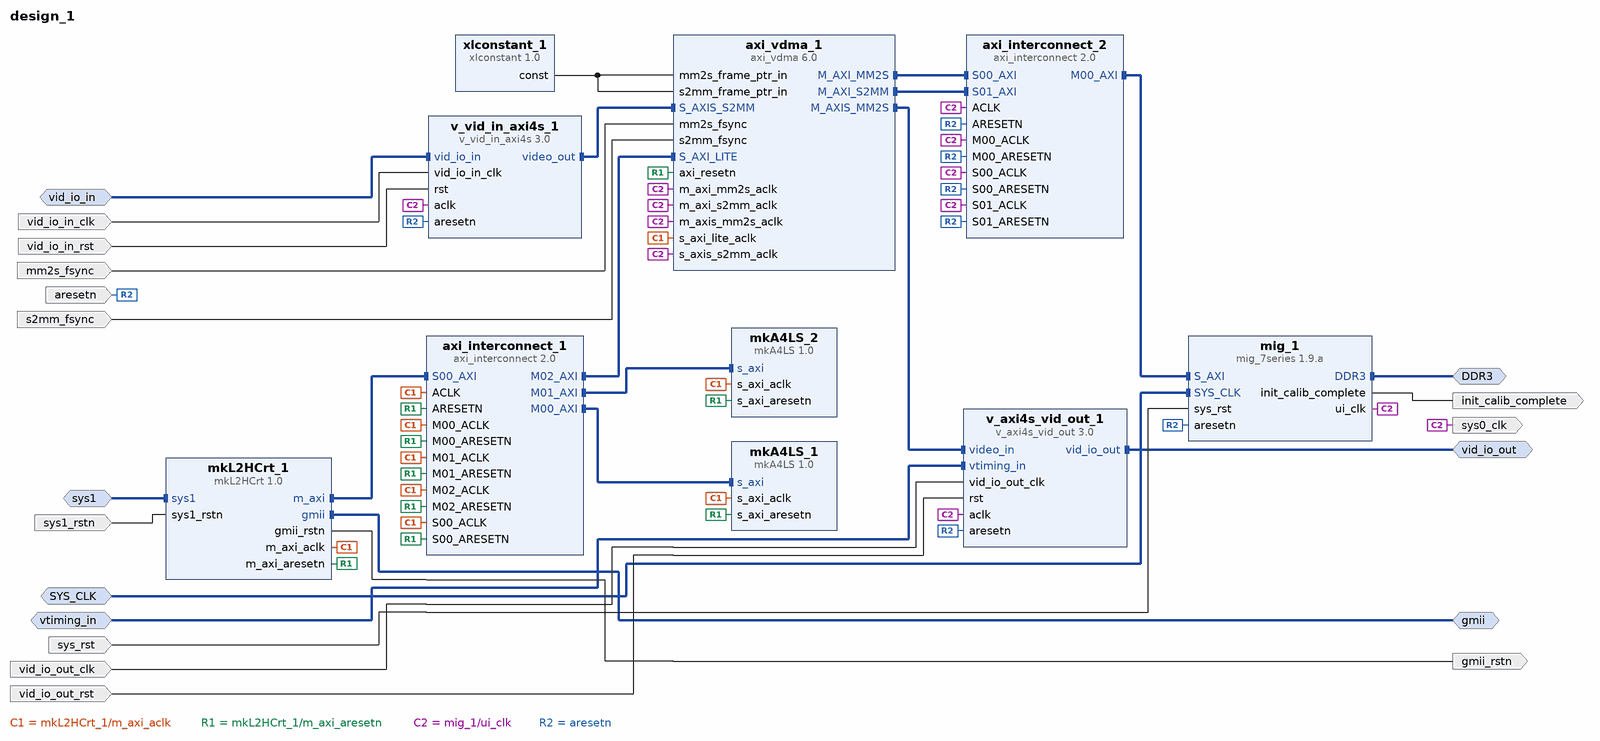
[diagram p0: block diagram of the top level]
# Vivado block design design_1, Vivado 2013.1.0
create_bd_design design_1

create_bd_intf_port -mode Master -vlnv xilinx.com:interface:gmii_rtl:1.0 gmii
create_bd_intf_port -mode Slave -vlnv xilinx.com:interface:diff_clock_rtl:1.0 sys1
set_property -dict {CONFIG.FREQ_HZ 125000000} [get_bd_intf_ports sys1]
create_bd_intf_port -mode Slave -vlnv xilinx.com:interface:diff_clock_rtl:1.0 SYS_CLK
set_property -dict {CONFIG.FREQ_HZ 200000000} [get_bd_intf_ports SYS_CLK]
create_bd_intf_port -mode Master -vlnv xilinx.com:interface:ddrx_rtl:1.0 DDR3
create_bd_intf_port -mode Master -vlnv xilinx.com:interface:vid_io_rtl:1.0 vid_io_out
create_bd_intf_port -mode Slave -vlnv xilinx.com:interface:video_timing_rtl:2.0 vtiming_in
create_bd_intf_port -mode Slave -vlnv xilinx.com:interface:vid_io_rtl:1.0 vid_io_in
create_bd_port -dir O -type rst gmii_rstn
set_property -dict {CONFIG.POLARITY ACTIVE_HIGH} [get_bd_ports gmii_rstn]
create_bd_port -dir I sys1_rstn
create_bd_port -dir I -type rst sys_rst
set_property -dict {CONFIG.POLARITY ACTIVE_HIGH} [get_bd_ports sys_rst]
create_bd_port -dir O init_calib_complete
create_bd_port -dir O -type clk sys0_clk
set_property -dict {CONFIG.FREQ_HZ 200000000 CONFIG.PHASE 337.5 CONFIG.CLK_DOMAIN design_1_mig_1_0_ui_clk} [get_bd_ports sys0_clk]
create_bd_port -dir I -type rst aresetn
set_property -dict {CONFIG.POLARITY ACTIVE_LOW} [get_bd_ports aresetn]
create_bd_port -dir I vid_io_in_clk
create_bd_port -dir I vid_io_out_clk
create_bd_port -dir I mm2s_fsync
create_bd_port -dir I s2mm_fsync
create_bd_port -dir I -type rst vid_io_in_rst
set_property -dict {CONFIG.POLARITY ACTIVE_HIGH} [get_bd_ports vid_io_in_rst]
create_bd_port -dir I -type rst vid_io_out_rst
set_property -dict {CONFIG.POLARITY ACTIVE_HIGH} [get_bd_ports vid_io_out_rst]

create_bd_cell -type ip -vlnv atomicrules.com:hotline:mkA4LS:1.0 mkA4LS_1
create_bd_cell -type ip -vlnv atomicrules.com:hotline:mkL2HCrt:1.0 mkL2HCrt_1
create_bd_cell -type ip -vlnv xilinx.com:ip:mig_7series:1.9.a mig_1
set_property -dict {CONFIG.XML_INPUT_FILE /home/shep/projects/hotline/data/mig_200MHz_16B.prj} [get_bd_cells mig_1]
create_bd_cell -type ip -vlnv xilinx.com:ip:axi_interconnect:2.0 axi_interconnect_1
set_property -dict {CONFIG.NUM_SI 1 CONFIG.NUM_MI 3} [get_bd_cells axi_interconnect_1]
create_bd_cell -type ip -vlnv atomicrules.com:hotline:mkA4LS:1.0 mkA4LS_2
create_bd_cell -type ip -vlnv xilinx.com:ip:axi_vdma:6.0 axi_vdma_1
set_property -dict [list \
  CONFIG.c_num_fstores 3 \
  CONFIG.c_use_mm2s_fsync 1 \
  CONFIG.c_use_s2mm_fsync 1 \
  CONFIG.c_mm2s_genlock_mode 1 \
  CONFIG.c_s2mm_genlock_mode 1 \
  CONFIG.c_include_s2mm 1 \
] [get_bd_cells axi_vdma_1]
create_bd_cell -type ip -vlnv xilinx.com:ip:axi_interconnect:2.0 axi_interconnect_2
set_property -dict {CONFIG.NUM_SI 2 CONFIG.NUM_MI 1} [get_bd_cells axi_interconnect_2]
create_bd_cell -type ip -vlnv xilinx.com:ip:v_axi4s_vid_out:3.0 v_axi4s_vid_out_1
set_property -dict {CONFIG.C_S_AXIS_VIDEO_FORMAT 0} [get_bd_cells v_axi4s_vid_out_1]
create_bd_cell -type ip -vlnv xilinx.com:ip:v_vid_in_axi4s:3.0 v_vid_in_axi4s_1
set_property -dict {CONFIG.C_M_AXIS_VIDEO_FORMAT 0} [get_bd_cells v_vid_in_axi4s_1]
create_bd_cell -type ip -vlnv xilinx.com:ip:xlconstant:1.0 xlconstant_1
set_property -dict {CONFIG.CONST_WIDTH 6 CONFIG.CONST_VAL 0} [get_bd_cells xlconstant_1]

# ---- connections ----

connect_bd_intf_net [get_bd_intf_pins mkL2HCrt_1/m_axi] [get_bd_intf_pins axi_interconnect_1/S00_AXI]
connect_bd_intf_net [get_bd_intf_pins mkA4LS_1/s_axi] [get_bd_intf_pins axi_interconnect_1/M00_AXI]
connect_bd_intf_net [get_bd_intf_pins mkA4LS_2/s_axi] [get_bd_intf_pins axi_interconnect_1/M01_AXI]
connect_bd_intf_net [get_bd_intf_pins axi_vdma_1/S_AXI_LITE] [get_bd_intf_pins axi_interconnect_1/M02_AXI]
connect_bd_intf_net [get_bd_intf_pins axi_interconnect_2/S00_AXI] [get_bd_intf_pins axi_vdma_1/M_AXI_MM2S]
connect_bd_intf_net [get_bd_intf_pins axi_interconnect_2/S01_AXI] [get_bd_intf_pins axi_vdma_1/M_AXI_S2MM]
connect_bd_intf_net [get_bd_intf_pins mig_1/S_AXI] [get_bd_intf_pins axi_interconnect_2/M00_AXI]
connect_bd_intf_net [get_bd_intf_pins axi_vdma_1/M_AXIS_MM2S] [get_bd_intf_pins v_axi4s_vid_out_1/video_in]
connect_bd_intf_net [get_bd_intf_pins axi_vdma_1/S_AXIS_S2MM] [get_bd_intf_pins v_vid_in_axi4s_1/video_out]
connect_bd_intf_net [get_bd_intf_ports gmii] [get_bd_intf_pins mkL2HCrt_1/gmii]
connect_bd_intf_net -intf_net sys1_1 [get_bd_intf_ports sys1] [get_bd_intf_pins mkL2HCrt_1/sys1]
connect_bd_intf_net [get_bd_intf_ports SYS_CLK] [get_bd_intf_pins mig_1/SYS_CLK]
connect_bd_intf_net [get_bd_intf_ports DDR3] [get_bd_intf_pins mig_1/DDR3]
connect_bd_intf_net [get_bd_intf_ports vid_io_out] [get_bd_intf_pins v_axi4s_vid_out_1/vid_io_out]
connect_bd_intf_net [get_bd_intf_ports vtiming_in] [get_bd_intf_pins v_axi4s_vid_out_1/vtiming_in]
connect_bd_intf_net [get_bd_intf_ports vid_io_in] [get_bd_intf_pins v_vid_in_axi4s_1/vid_io_in]
connect_bd_net [get_bd_pins mkL2HCrt_1/gmii_rstn] [get_bd_ports gmii_rstn]
connect_bd_net [get_bd_ports sys1_rstn] [get_bd_pins mkL2HCrt_1/sys1_rstn]
connect_bd_net [get_bd_pins mkL2HCrt_1/m_axi_aclk] \
  [get_bd_pins axi_interconnect_1/S00_ACLK] [get_bd_pins axi_interconnect_1/ACLK] [get_bd_pins mkA4LS_1/s_axi_aclk] \
  [get_bd_pins axi_interconnect_1/M00_ACLK] [get_bd_pins axi_interconnect_1/M01_ACLK] \
  [get_bd_pins axi_interconnect_1/M02_ACLK] [get_bd_pins mkA4LS_2/s_axi_aclk] [get_bd_pins axi_vdma_1/s_axi_lite_aclk]
connect_bd_net [get_bd_ports sys_rst] [get_bd_pins mig_1/sys_rst]
connect_bd_net [get_bd_pins mig_1/init_calib_complete] [get_bd_ports init_calib_complete]
connect_bd_net [get_bd_pins mkL2HCrt_1/m_axi_aresetn] \
  [get_bd_pins axi_interconnect_1/S00_ARESETN] [get_bd_pins axi_interconnect_1/M02_ARESETN] \
  [get_bd_pins axi_interconnect_1/M01_ARESETN] [get_bd_pins axi_interconnect_1/M00_ARESETN] \
  [get_bd_pins axi_interconnect_1/ARESETN] [get_bd_pins mkA4LS_1/s_axi_aresetn] [get_bd_pins mkA4LS_2/s_axi_aresetn] \
  [get_bd_pins axi_vdma_1/axi_resetn]
connect_bd_net [get_bd_pins mig_1/ui_clk] \
  [get_bd_ports sys0_clk] [get_bd_pins axi_vdma_1/m_axi_mm2s_aclk] [get_bd_pins axi_vdma_1/m_axis_mm2s_aclk] \
  [get_bd_pins axi_vdma_1/m_axi_s2mm_aclk] [get_bd_pins axi_vdma_1/s_axis_s2mm_aclk] [get_bd_pins axi_interconnect_2/ACLK] \
  [get_bd_pins axi_interconnect_2/S00_ACLK] [get_bd_pins axi_interconnect_2/M00_ACLK] \
  [get_bd_pins axi_interconnect_2/S01_ACLK] [get_bd_pins v_axi4s_vid_out_1/aclk] [get_bd_pins v_vid_in_axi4s_1/aclk]
connect_bd_net [get_bd_ports aresetn] \
  [get_bd_pins mig_1/aresetn] [get_bd_pins axi_interconnect_2/ARESETN] [get_bd_pins axi_interconnect_2/S00_ARESETN] \
  [get_bd_pins axi_interconnect_2/M00_ARESETN] [get_bd_pins axi_interconnect_2/S01_ARESETN] \
  [get_bd_pins v_axi4s_vid_out_1/aresetn] [get_bd_pins v_vid_in_axi4s_1/aresetn]
connect_bd_net [get_bd_ports vid_io_in_clk] [get_bd_pins v_vid_in_axi4s_1/vid_io_in_clk]
connect_bd_net [get_bd_ports vid_io_out_clk] [get_bd_pins v_axi4s_vid_out_1/vid_io_out_clk]
connect_bd_net [get_bd_ports mm2s_fsync] [get_bd_pins axi_vdma_1/mm2s_fsync]
connect_bd_net [get_bd_ports s2mm_fsync] [get_bd_pins axi_vdma_1/s2mm_fsync]
connect_bd_net -net rst_1 [get_bd_ports vid_io_in_rst] [get_bd_pins v_vid_in_axi4s_1/rst]
connect_bd_net -net rst_2 [get_bd_ports vid_io_out_rst] [get_bd_pins v_axi4s_vid_out_1/rst]
connect_bd_net [get_bd_pins xlconstant_1/const] [get_bd_pins axi_vdma_1/mm2s_frame_ptr_in] [get_bd_pins axi_vdma_1/s2mm_frame_ptr_in]

# ---- address map ----
assign_bd_address -offset 0x80000000 -range 1G -target_address_space [get_bd_addr_spaces axi_vdma_1/Data_MM2S] [get_bd_addr_segs mig_1/memmap/memaddr]
assign_bd_address -offset 0x80000000 -range 1G -target_address_space [get_bd_addr_spaces axi_vdma_1/Data_S2MM] [get_bd_addr_segs mig_1/memmap/memaddr]
assign_bd_address -offset 0x00000000 -range 4K -target_address_space [get_bd_addr_spaces mkL2HCrt_1/m_axi] [get_bd_addr_segs mkA4LS_1/s_axi/reg0]
assign_bd_address -offset 0x00010000 -range 4K -target_address_space [get_bd_addr_spaces mkL2HCrt_1/m_axi] [get_bd_addr_segs mkA4LS_2/s_axi/reg0]
assign_bd_address -offset 0x00020000 -range 64K -target_address_space [get_bd_addr_spaces mkL2HCrt_1/m_axi] [get_bd_addr_segs axi_vdma_1/S_AXI_LITE/Reg]

validate_bd_design
save_bd_design
